# Altium schematic sheet PCB_PI3_v0.1.SchDoc: PCB_PI3
size A3; Date: 29/01/2025; CheckedBy: Joana W.; Author: Joana W., Cícero D.; DrawnBy: <nome>; Engineer: <nome>; Organization: IFSC; DocumentNumber: 1; Revision: 0.1; SheetNumber: 1; SheetTotal: 1; Status: Em desenvolvimento
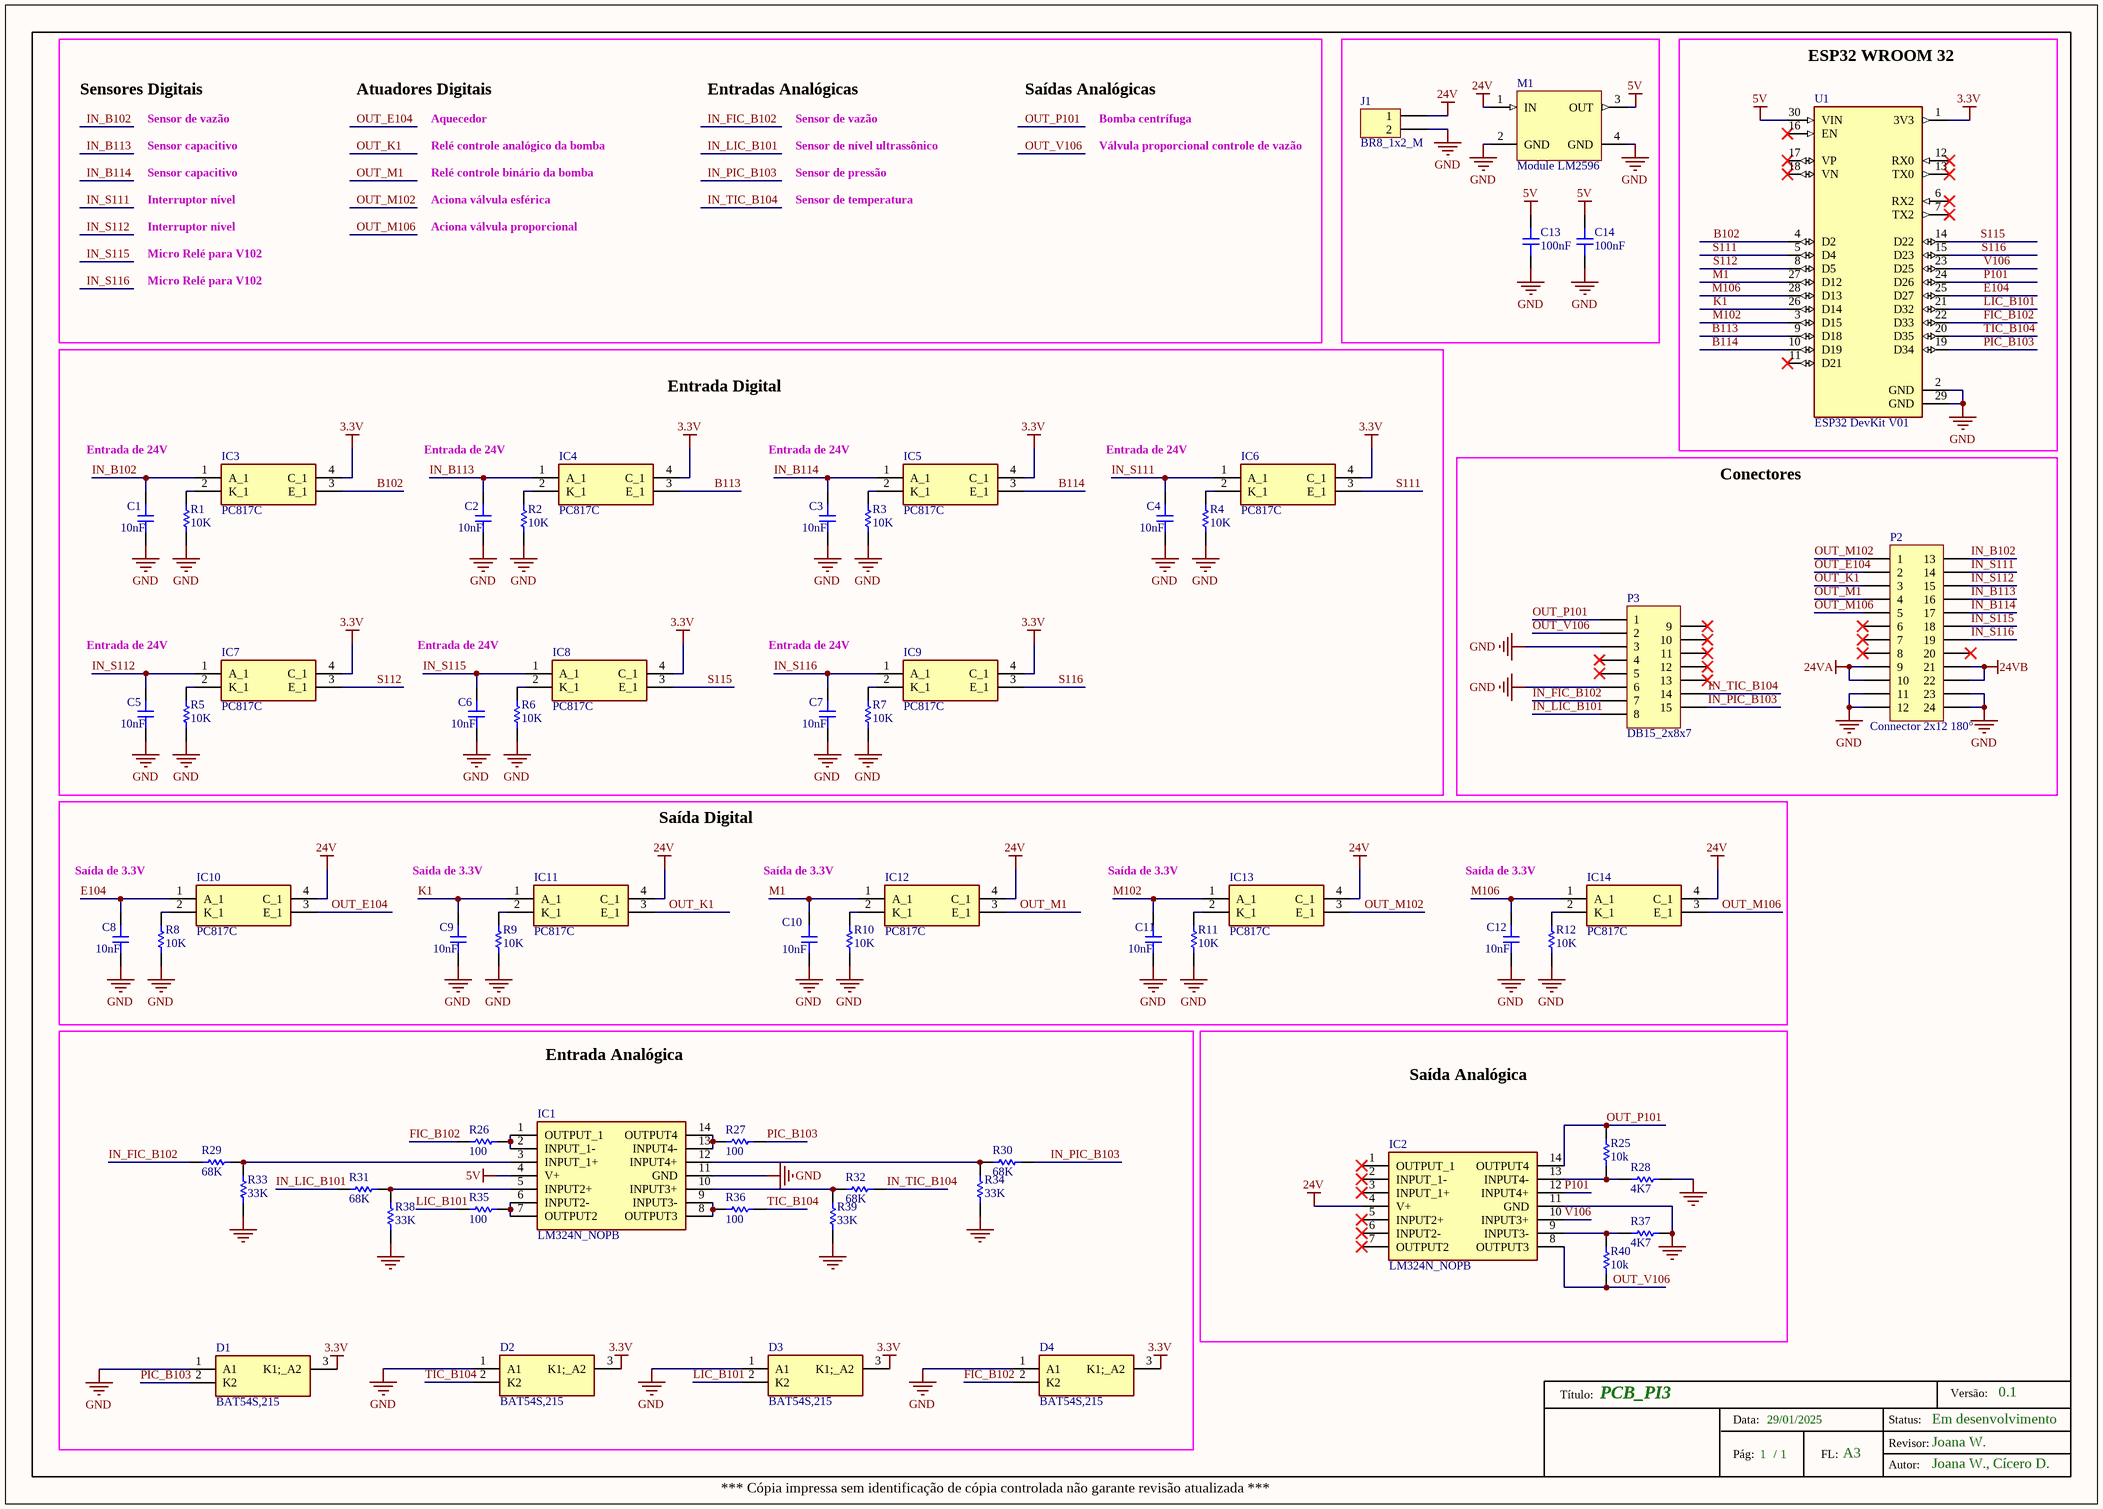
[diagram p0: PCB_PI3_v0.1.SchDoc]

## Parts
C1  10nF  [0805C]
C2  10nF  [0805C]
C3  10nF  [0805C]
C4  10nF  [0805C]
C5  10nF  [0805C]
C6  10nF  [0805C]
C7  10nF  [0805C]
C8  10nF  [0805C]
C9  10nF  [0805C]
C10  10nF  [0805C]
C11  10nF  [0805C]
C12  10nF  [0805C]
C13  100nF  [0805C]
C14  100nF  [0805C]
D1  BAT54S,215  [SOT95P230X110-3N]
D2  BAT54S,215  [SOT95P230X110-3N]
D3  BAT54S,215  [SOT95P230X110-3N]
D4  BAT54S,215  [SOT95P230X110-3N]
IC1  LM324N_NOPB  [DIP794W56P254L1905H533Q14N]
IC2  LM324N_NOPB  [DIP794W56P254L1905H533Q14N]
IC3  PC817C  [DIP762W60P254L458H450Q4N]
IC4  PC817C  [DIP762W60P254L458H450Q4N]
IC5  PC817C  [DIP762W60P254L458H450Q4N]
IC6  PC817C  [DIP762W60P254L458H450Q4N]
IC7  PC817C  [DIP762W60P254L458H450Q4N]
IC8  PC817C  [DIP762W60P254L458H450Q4N]
IC9  PC817C  [DIP762W60P254L458H450Q4N]
IC10  PC817C  [DIP762W60P254L458H450Q4N]
IC11  PC817C  [DIP762W60P254L458H450Q4N]
IC12  PC817C  [DIP762W60P254L458H450Q4N]
IC13  PC817C  [DIP762W60P254L458H450Q4N]
IC14  PC817C  [DIP762W60P254L458H450Q4N]
J1  BR8_1x2_M  [BR8_1X2_M]
M1  Module LM2596  [MOD_LM2596]
P2  Connector 2x12 180°  [ds1039]
P3  DB15_2x8x7  [ds1033]
R1  10K  [0805R]
R2  10K  [0805R]
R3  10K  [0805R]
R4  10K  [0805R]
R5  10K  [0805R]
R6  10K  [0805R]
R7  10K  [0805R]
R8  10K  [0805R]
R9  10K  [0805R]
R10  10K  [0805R]
R11  10K  [0805R]
R12  10K  [0805R]
R25  10k  [RESISTOR]
R26  100  [RESISTOR]
R27  100  [RESISTOR]
R28  4K7  [RESISTOR]
R29  68K  [RESISTOR]
R30  68K  [RESISTOR]
R31  68K  [RESISTOR]
R32  68K  [RESISTOR]
R33  33K  [RESISTOR]
R34  33K  [RESISTOR]
R35  100  [RESISTOR]
R36  100  [RESISTOR]
R37  4K7  [RESISTOR]
R38  33K  [RESISTOR]
R39  33K  [RESISTOR]
R40  10k  [RESISTOR]
U1  ESP32 DevKit V01  [ESP32-DEVKIT-V1]

## Blocks framed on the sheet
ESP32 WROOM 32: U1
Entrada Digital: C1-C7 IC3-IC9 R1-R7
Conectores: P2 P3
Saída Digital: C8-C12 IC10-IC14 R8-R12
Entrada Analógica: D1-D4 IC1 R26 R27 R29-R36 R38 R39
Saída Analógica: IC2 R25 R28 R37 R40

## Nets
3.3V: D1.3(K1;_A2) D2.3(K1;_A2) D3.3(K1;_A2) D4.3(K1;_A2) IC3.4(C_1) IC4.4(C_1) IC5.4(C_1) IC6.4(C_1) IC7.4(C_1) IC8.4(C_1) IC9.4(C_1) U1.1(3V3)
5V: C13.2 C14.2 IC1.4(V+) M1.3(OUT) U1.30(VIN)
24V: IC2.4(V+) IC10.4(C_1) IC11.4(C_1) IC12.4(C_1) IC13.4(C_1) IC14.4(C_1) J1.1 M1.1(IN)
24VA: P2.9 P2.10
24VB: P2.21 P2.22
GND: C1.1 C2.1 C3.1 C4.1 C5.1 C6.1 C7.1 C8.1 C9.1 C10.1 C11.1 C12.1 C13.1 C14.1 D1.1(A1) D2.1(A1) D3.1(A1) D4.1(A1) IC1.11(GND) IC2.11(GND) J1.2 M1.2(GND) M1.4(GND) P2.11 P2.12 P2.23 P2.24 P3.3 P3.6 R1.1 R2.1 R3.1 R4.1 R5.1 R6.1 R7.1 R8.1 R9.1 R10.1 R11.1 R12.1 R28.1 R33.1 R34.1 R37.1 R38.1 R39.1 U1.2(GND) U1.29(GND)
B102: IC3.3(E_1) U1.4(D2)
B113: IC4.3(E_1) U1.9(D18)
B114: IC5.3(E_1) U1.10(D19)
E104: C8.2 IC10.1(A_1) U1.25(D27)
FIC_B102: D4.2(K2) R26.2 U1.22(D33)
IN_B102: C1.2 IC3.1(A_1) P2.13
IN_B113: C2.2 IC4.1(A_1) P2.16
IN_B114: C3.2 IC5.1(A_1) P2.17
IN_FIC_B102: P3.7 R29.2
IN_LIC_B101: P3.8 R31.2
IN_PIC_B103: P3.15 R30.1
IN_S111: C4.2 IC6.1(A_1) P2.14
IN_S112: C5.2 IC7.1(A_1) P2.15
IN_S115: C6.2 IC8.1(A_1) P2.18
IN_S116: C7.2 IC9.1(A_1) P2.19
IN_TIC_B104: P3.14 R32.1
K1: C9.2 IC11.1(A_1) U1.26(D14)
LIC_B101: D3.2(K2) R35.2 U1.21(D32)
M1: C10.2 IC12.1(A_1) U1.27(D12)
M102: C11.2 IC13.1(A_1) U1.3(D15)
M106: C12.2 IC14.1(A_1) U1.28(D13)
OUT_E104: IC10.3(E_1) P2.2
OUT_K1: IC11.3(E_1) P2.3
OUT_M1: IC12.3(E_1) P2.4
OUT_M102: IC13.3(E_1) P2.1
OUT_M106: IC14.3(E_1) P2.5
OUT_P101: IC2.14(OUTPUT4) P3.1 R25.2
OUT_V106: IC2.8(OUTPUT3) P3.2 R40.1
P101: IC2.12(INPUT4+) U1.24(D26)
PIC_B103: D1.2(K2) R27.1 U1.19(D34)
S111: IC6.3(E_1) U1.5(D4)
S112: IC7.3(E_1) U1.8(D5)
S115: IC8.3(E_1) U1.14(D22)
S116: IC9.3(E_1) U1.15(D23)
TIC_B104: D2.2(K2) R36.1 U1.20(D35)
V106: IC2.10(INPUT3+) U1.23(D25)
NetIC1_1: IC1.1(OUTPUT_1) IC1.2(INPUT_1-) R26.1
NetIC1_3: IC1.3(INPUT_1+) R29.1 R33.2
NetIC1_5: IC1.5(INPUT2+) R31.1 R38.2
NetIC1_6: IC1.6(INPUT2-) IC1.7(OUTPUT2) R35.1
NetIC1_8: IC1.8(OUTPUT3) IC1.9(INPUT3-) R36.2
NetIC1_10: IC1.10(INPUT3+) R32.2 R39.2
NetIC1_12: IC1.12(INPUT4+) R30.2 R34.2
NetIC1_13: IC1.13(INPUT4-) IC1.14(OUTPUT4) R27.2
NetIC2_9: IC2.9(INPUT3-) R37.2 R40.2
NetIC2_13: IC2.13(INPUT4-) R25.1 R28.2
NetIC3_2: IC3.2(K_1) R1.2
NetIC4_2: IC4.2(K_1) R2.2
NetIC5_2: IC5.2(K_1) R3.2
NetIC6_2: IC6.2(K_1) R4.2
NetIC7_2: IC7.2(K_1) R5.2
NetIC8_2: IC8.2(K_1) R6.2
NetIC9_2: IC9.2(K_1) R7.2
NetIC10_2: IC10.2(K_1) R8.2
NetIC11_2: IC11.2(K_1) R9.2
NetIC12_2: IC12.2(K_1) R10.2
NetIC13_2: IC13.2(K_1) R11.2
NetIC14_2: IC14.2(K_1) R12.2

Not connected (* = marked no-connect by the designer): IC2 1(OUTPUT_1)* 2(INPUT_1-)* 3(INPUT_1+)* 5(INPUT2+)* 6(INPUT2-)* 7(OUTPUT2)*; P2 6* 7* 8* 20*; P3 4* 5* 9* 10* 11* 12* 13*; U1 6(RX2)* 7(TX2)* 11(D21)* 12(RX0)* 13(TX0)* 16(EN)* 17(VP)* 18(VN)*

## Notes on the sheet
- Sensores Digitais
- Atuadores Digitais
- Entradas Analógicas
- Saídas Analógicas
- Sensor de vazão
- Sensor capacitivo
- Aquecedor
- Relé controle analógico da bomba
- Relé controle binário da bomba
- Sensor de nível ultrassônico
- Sensor de pressão
- Bomba centrífuga
- Válvula proporcional controle de vazão
- Interruptor nível
- Aciona válvula esférica
- Aciona válvula proporcional
- Sensor de temperatura
- Micro Relé para V102
- Entrada de 24V
- Saída de 3.3V
- Título:
- Versão:
- Data:
- Pág:
- /
- FL:
- A3
- Revisor:
- Status:
- *** Cópia impressa sem identificação de cópia controlada não garante revisão atualizada ***
- Autor:

## Library data of the parts
C1-C12 = C_10nF_0805: CAP CER 10nF 50V X7R 0805; Max_Tolerance_Allowed: 10%; Type: Ceramic; Voltage: 50V; Value: 10nF; Temperature_Coefficient: X7R; Package: 0805; JLCPCB_Part: C1710; ML_Part: *; Soldar: *
C13 C14 = C_100nF_0805: CAP CER 100nF 50V X7R 0805; Max_Tolerance_Allowed: 10%; Type: Ceramic; Voltage: 50V; Value: 100nF; Temperature_Coefficient: X7R; Package: 0805; JLCPCB_Part: C49678; ML_Part: *; Soldar: *
D1-D4 = BAT54S,215: Schottky Diode; Manufacturer_Name: Nexperia; Datasheet Link: https://assets.nexperia.com/documents/data-sheet/BAT54S.pdf; Height: 1.1mm; Manufacturer_Part_Number: BAT54S,215; Mouser Part Number: 771-BAT54S-T/R; Mouser Price/Stock: https://www.mouser.co.uk/ProductDetail/Nexperia/BAT54S215?qs=me8TqzrmIYVOaf3j7zH0Wg%3D%3D; Arrow Part Number: BAT54S,215; Arrow Price/Stock: https://www.arrow.com/en/products/bat54s215/nexperia?region=europe
IC1 IC2 = LM324N_NOPB: Integrated Circuit; Manufacturer_Name: Texas Instruments; Manufacturer_Part_Number: LM324N/NOPB; Datasheet Link: http://www.ti.com/general/docs/lit/getliterature.tsp?genericPartNumber=LM324-N&fileType=pdf&HQS=ti-null-null-sf-df-pf-sep-wwe&DCM=yes; Height: 5.334mm; Mouser Part Number: 926-LM324N/NOPB; Mouser Price/Stock: https://www.mouser.co.uk/ProductDetail/Texas-Instruments/LM324N-NOPB?qs=X1J7HmVL2ZGOUbLumEeh2Q%3D%3D; Arrow Part Number: LM324N/NOPB; Arrow Price/Stock: https://www.arrow.com/en/products/lm324nnopb/texas-instruments?utm_currency=USD&region=nac
IC3-IC14 = PC817C: Integrated Circuit; Manufacturer_Name: Sharp Microelectronics; Datasheet Link: https://datasheet.datasheetarchive.com/originals/distributors/Datasheets-31/DSA-613071.pdf; Height: 4.5mm; Manufacturer_Part_Number: PC817C
J1 = BR8_1x2_M: BR8 Metaltex connector, 1x2, male, 180°; Manufacturer_Part: BR8MC1-02; ML_Part: CPE08001; Pitch: 5,08mm; Positions: 2; Row: 1; Voltage: 300V; Current: 15A; Type: Male 180°; Datasheet: https://www.metaltex.com.br/assets/produtos/pdf/br8.pdf; Soldar: *
M1 = Mod_Header_LM2596: LM2596 4 Pins; Pitch: 2,54mm; Length: 11,2mm; Soldar: *; Module_Description: LM2596
P2 = Connector_2x12_F: Connector DS1078 Female, 180°, 2 Lines, 12 Columns, 24 Pins; Length: 11,2mm; Soldar: *
P3 = Connector_2x7e8_F: Connector DB15 female, 180º, 2 Lines, 7e8 Columns, 26 Pins; Length: 11.2mm; Soldar: *
R1-R12 = R_10K_0805: RES 10K OHM 5% 1/8W 0805; Max_Tolerance_Allowed: 5%; Min_Power_Allowed: 1/8 W; Package: 0805; JLCPCB_Part: C17414; Value: 10K; ML_Part: *; Soldar: *
R25 R40 = R_10k: RES 10k OHM 5% 1/8W; Max_Tolerance_Allowed: 5%; Min_Power_Allowed: 1/8 W; JLCPCB_Part: C17513; Value: 10k; ML_Part: *; Soldar: *
R26 R27 R35 R36 = R_0R100: RES 100 OHM 5% 1/8; Max_Tolerance_Allowed: 1%; Min_Power_Allowed: 1/8 W; Value: 100 Ohm; ML_Part: *; Soldar: *
R28 R37 = R_4K7: RES 4K7 OHM 5% 1/8W; Max_Tolerance_Allowed: 5%; Min_Power_Allowed: 1/8 W; JLCPCB_Part: C17513; Value: 4K7; ML_Part: *; Soldar: *
R29-R32 = R_68K: RES 68K OHM 5% 1/8W; Max_Tolerance_Allowed: 5%; Min_Power_Allowed: 1/8 W; JLCPCB_Part: C17513; Value: 68K; ML_Part: *; Soldar: *
R33 R34 R38 R39 = R_33K: RES 33K OHM 5% 1/8W; Max_Tolerance_Allowed: 5%; Min_Power_Allowed: 1/8 W; JLCPCB_Part: C17513; Value: 33K; ML_Part: *; Soldar: *
U1 = ESP32_DEVKIT: IC MCU 32BIT ESP32 DEVKIT V01; Manufacturer_Name: Doit; Manufacturer_Part_Number: ESP-32-DEVKIT-V1; ML_Part: CPE11011; Voltage: 3.3V; Datasheet: https://roboeq.ir/files/id/4034/name/ESP32%20MODULE.pdf/; Height: 4.5mm; Soldar: *